# Altium project HFPB_01.PrjPcb (part 3 of 3)

## Sheet HFPB_01, PAGE-2.SchDoc
size 420 x 297 mm; PageSetup: Record=PageOptions|CenterHorizontal=True|CenterVertical=True|PrintScale=0.71|XCorrection=1.00|YCorrection=1.00|PrintKind=0|BorderSize=5000000|LeftOffset=0|BottomOffset=0|Orientation=2|PaperLength=1000|PaperWidth=1000|Scale=100|PaperSource=7|PrintQuality=-3|MediaType=1|DitherType=10|PaperKind=A4|PrintScaleMode=1; DocumentNumber: HFPB_01; Revision: .01; SheetNumber: 2; SheetTotal: 2; PageName: Power Bridge
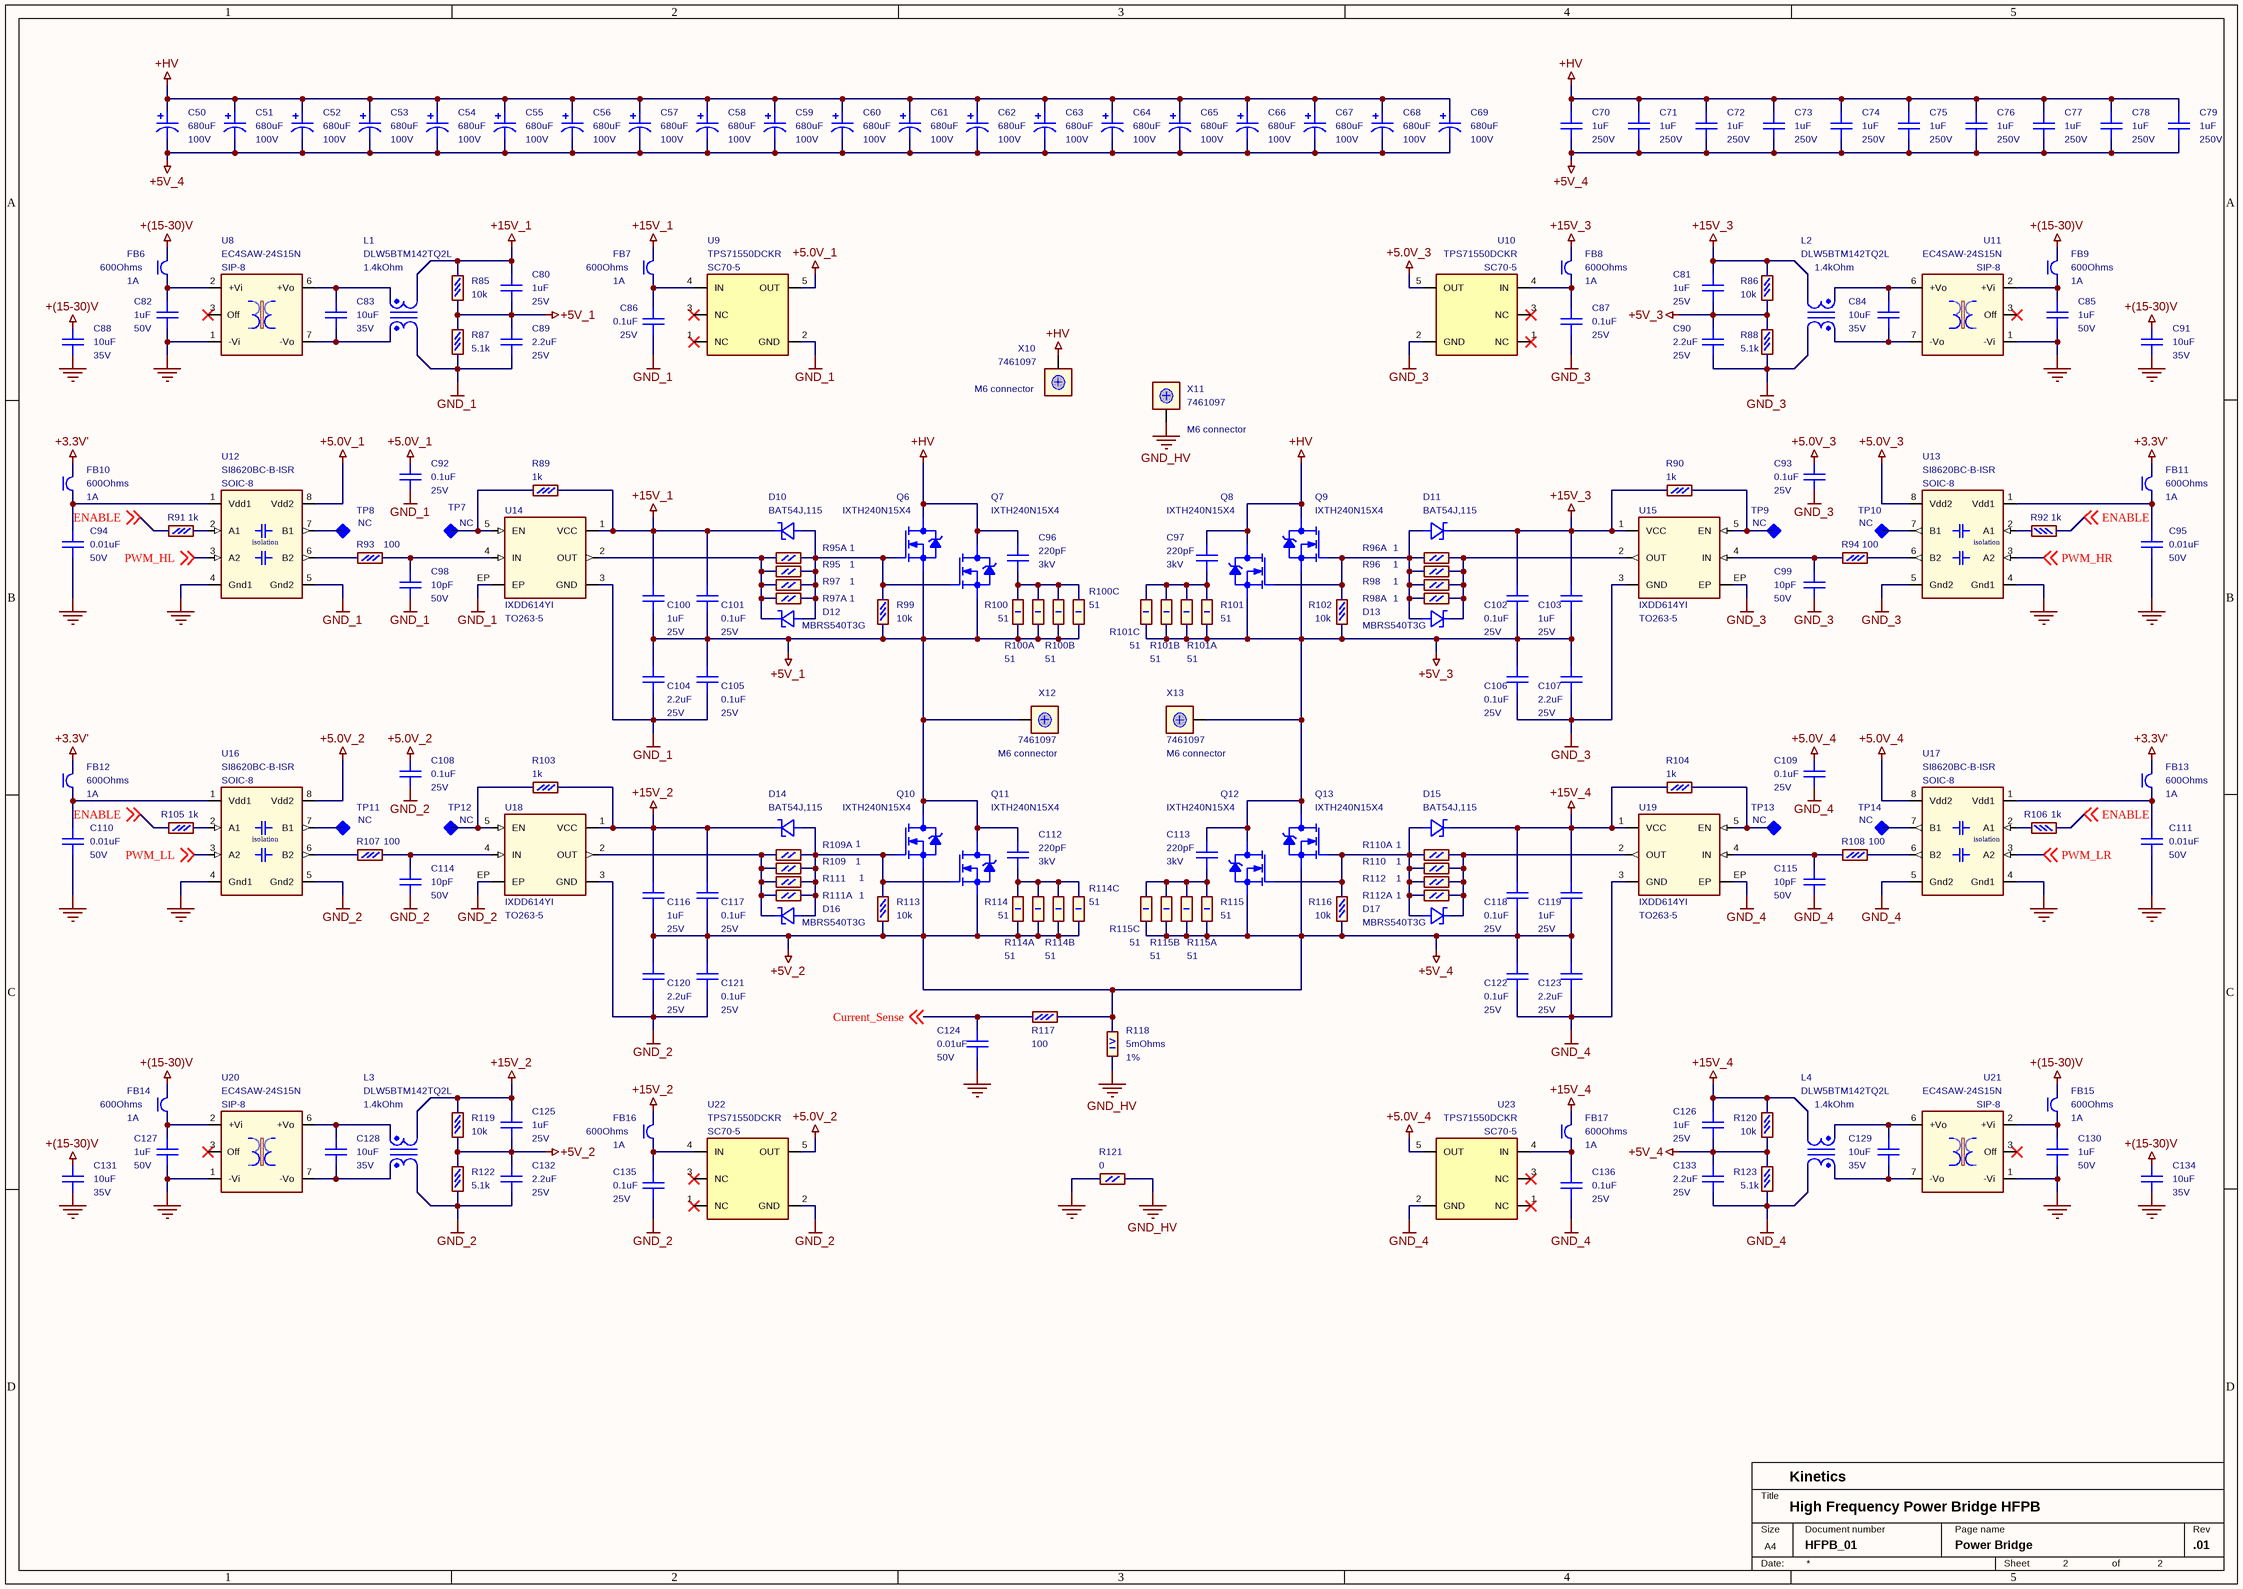
[diagram p1: HFPB_01, PAGE-2.SchDoc]

### Parts
C50  680uF  Value3: 100V  [CAPPRD750W80D1820H4200]
C51  680uF  Value3: 100V  [CAPPRD750W80D1820H4200]
C52  680uF  Value3: 100V  [CAPPRD750W80D1820H4200]
C53  680uF  Value3: 100V  [CAPPRD750W80D1820H4200]
C54  680uF  Value3: 100V  [CAPPRD750W80D1820H4200]
C55  680uF  Value3: 100V  [CAPPRD750W80D1820H4200]
C56  680uF  Value3: 100V  [CAPPRD750W80D1820H4200]
C57  680uF  Value3: 100V  [CAPPRD750W80D1820H4200]
C58  680uF  Value3: 100V  [CAPPRD750W80D1820H4200]
C59  680uF  Value3: 100V  [CAPPRD750W80D1820H4200]
C60  680uF  Value3: 100V  [CAPPRD750W80D1820H4200]
C61  680uF  Value3: 100V  [CAPPRD750W80D1820H4200]
C62  680uF  Value3: 100V  [CAPPRD750W80D1820H4200]
C63  680uF  Value3: 100V  [CAPPRD750W80D1820H4200]
C64  680uF  Value3: 100V  [CAPPRD750W80D1820H4200]
C65  680uF  Value3: 100V  [CAPPRD750W80D1820H4200]
C66  680uF  Value3: 100V  [CAPPRD750W80D1820H4200]
C67  680uF  Value3: 100V  [CAPPRD750W80D1820H4200]
C68  680uF  Value3: 100V  [CAPPRD750W80D1820H4200]
C69  680uF  Value3: 100V  [CAPPRD750W80D1820H4200]
C70  1uF  Value3: 250V  [CAPC570X500X160L60N]
C71  1uF  Value3: 250V  [CAPC570X500X160L60N]
C72  1uF  Value3: 250V  [CAPC570X500X160L60N]
C73  1uF  Value3: 250V  [CAPC570X500X160L60N]
C74  1uF  Value3: 250V  [CAPC570X500X160L60N]
C75  1uF  Value3: 250V  [CAPC570X500X160L60N]
C76  1uF  Value3: 250V  [CAPC570X500X160L60N]
C77  1uF  Value3: 250V  [CAPC570X500X160L60N]
C78  1uF  Value3: 250V  [CAPC570X500X160L60N]
C79  1uF  Value3: 250V  [CAPC570X500X160L60N]
C80  1uF  Value3: 25V  [CAPC160X80X80L35N - Full legend]
C81  1uF  Value3: 25V  [CAPC160X80X80L35N - Full legend]
C82  1uF  Value3: 50V  [CAPC160X80X80L35N - Full legend]
C83  10uF  Value3: 35V  [CAPC320X250X280L60N - full legend]
C84  10uF  Value3: 35V  [CAPC320X250X280L60N - full legend]
C85  1uF  Value3: 50V  [CAPC160X80X80L35N - Full legend]
C86  0.1uF  Value3: 25V  [CAPC160X80X80L35N - Full legend]
C87  0.1uF  Value3: 25V  [CAPC160X80X80L35N - Full legend]
C88  10uF  Value3: 35V  [CAPC320X250X280L60N - full legend]
C89  2.2uF  Value3: 25V  [CAPC160X80X80L35N - Full legend]
C90  2.2uF  Value3: 25V  [CAPC160X80X80L35N - Full legend]
C91  10uF  Value3: 35V  [CAPC320X250X280L60N - full legend]
C92  0.1uF  Value3: 25V  [CAPC160X80X80L35N - Full legend]
C93  0.1uF  Value3: 25V  [CAPC160X80X80L35N - Full legend]
C94  0.01uF  Value3: 50V  [CAPC160X80X80L35N - Full legend]
C95  0.01uF  Value3: 50V  [CAPC160X80X80L35N - Full legend]
C96  220pF  Value3: 3kV  [CAPC450X320X140L60N]
C97  220pF  Value3: 3kV  [CAPC450X320X140L60N]
C98  10pF  Value3: 50V  [CAPC160X80X80L35N - Full legend]
C99  10pF  Value3: 50V  [CAPC160X80X80L35N - Full legend]
C100  1uF  Value3: 25V  [CAPC160X80X80L35N - Full legend]
C101  0.1uF  Value3: 25V  [CAPC160X80X80L35N - Full legend]
C102  0.1uF  Value3: 25V  [CAPC160X80X80L35N - Full legend]
C103  1uF  Value3: 25V  [CAPC160X80X80L35N - Full legend]
C104  2.2uF  Value3: 25V  [CAPC160X80X80L35N - Full legend]
C105  0.1uF  Value3: 25V  [CAPC160X80X80L35N - Full legend]
C106  0.1uF  Value3: 25V  [CAPC160X80X80L35N - Full legend]
C107  2.2uF  Value3: 25V  [CAPC160X80X80L35N - Full legend]
C108  0.1uF  Value3: 25V  [CAPC160X80X80L35N - Full legend]
C109  0.1uF  Value3: 25V  [CAPC160X80X80L35N - Full legend]
C110  0.01uF  Value3: 50V  [CAPC160X80X80L35N - Full legend]
C111  0.01uF  Value3: 50V  [CAPC160X80X80L35N - Full legend]
C112  220pF  Value3: 3kV  [CAPC450X320X140L60N]
C113  220pF  Value3: 3kV  [CAPC450X320X140L60N]
C114  10pF  Value3: 50V  [CAPC160X80X80L35N - Full legend]
C115  10pF  Value3: 50V  [CAPC160X80X80L35N - Full legend]
C116  1uF  Value3: 25V  [CAPC160X80X80L35N - Full legend]
C117  0.1uF  Value3: 25V  [CAPC160X80X80L35N - Full legend]
C118  0.1uF  Value3: 25V  [CAPC160X80X80L35N - Full legend]
C119  1uF  Value3: 25V  [CAPC160X80X80L35N - Full legend]
C120  2.2uF  Value3: 25V  [CAPC160X80X80L35N - Full legend]
C121  0.1uF  Value3: 25V  [CAPC160X80X80L35N - Full legend]
C122  0.1uF  Value3: 25V  [CAPC160X80X80L35N - Full legend]
C123  2.2uF  Value3: 25V  [CAPC160X80X80L35N - Full legend]
C124  0.01uF  Value3: 50V  [CAPC160X80X80L35N - Full legend]
C125  1uF  Value3: 25V  [CAPC160X80X80L35N - Full legend]
C126  1uF  Value3: 25V  [CAPC160X80X80L35N - Full legend]
C127  1uF  Value3: 50V  [CAPC160X80X80L35N - Full legend]
C128  10uF  Value3: 35V  [CAPC320X250X280L60N - full legend]
C129  10uF  Value3: 35V  [CAPC320X250X280L60N - full legend]
C130  1uF  Value3: 50V  [CAPC160X80X80L35N - Full legend]
C131  10uF  Value3: 35V  [CAPC320X250X280L60N - full legend]
C132  2.2uF  Value3: 25V  [CAPC160X80X80L35N - Full legend]
C133  2.2uF  Value3: 25V  [CAPC160X80X80L35N - Full legend]
C134  10uF  Value3: 35V  [CAPC320X250X280L60N - full legend]
C135  0.1uF  Value3: 25V  [CAPC160X80X80L35N - Full legend]
C136  0.1uF  Value3: 25V  [CAPC160X80X80L35N - Full legend]
D10  BAT54J,115  [SODFL250X125X80L40X32N]
D11  BAT54J,115  [SODFL250X125X80L40X32N]
D12  MBRS540T3G  [DIOM795X585X240L100X300N]
D13  MBRS540T3G  [DIOM795X585X240L100X300N]
D14  BAT54J,115  [SODFL250X125X80L40X32N]
D15  BAT54J,115  [SODFL250X125X80L40X32N]
D16  MBRS540T3G  [DIOM795X585X240L100X300N]
D17  MBRS540T3G  [DIOM795X585X240L100X300N]
FB6  600Ohms  Value1: 1A  [BEADC160X80X80L30N]
FB7  600Ohms  Value1: 1A  [BEADC160X80X80L30N]
FB8  600Ohms  Value1: 1A  [BEADC160X80X80L30N]
FB9  600Ohms  Value1: 1A  [BEADC160X80X80L30N]
FB10  600Ohms  Value1: 1A  [BEADC160X80X80L30N]
FB11  600Ohms  Value1: 1A  [BEADC160X80X80L30N]
FB12  600Ohms  Value1: 1A  [BEADC160X80X80L30N]
FB13  600Ohms  Value1: 1A  [BEADC160X80X80L30N]
FB14  600Ohms  Value1: 1A  [BEADC160X80X80L30N]
FB15  600Ohms  Value1: 1A  [BEADC160X80X80L30N]
FB16  600Ohms  Value1: 1A  [BEADC160X80X80L30N]
FB17  600Ohms  Value1: 1A  [BEADC160X80X80L30N]
L1  DLW5BTM142TQ2L  value 1.4kOhm  [MURATA_DLW5BTM142TQ2L]
L2  DLW5BTM142TQ2L  value 1.4kOhm  [MURATA_DLW5BTM142TQ2L]
L3  DLW5BTM142TQ2L  value 1.4kOhm  [MURATA_DLW5BTM142TQ2L]
L4  DLW5BTM142TQ2L  value 1.4kOhm  [MURATA_DLW5BTM142TQ2L]
Q6  IXTH240N15X4  [TO247-3 - sgib]
Q7  IXTH240N15X4  [TO247-3 - short pins]
Q8  IXTH240N15X4  [TO247-3 - short pins]
Q9  IXTH240N15X4  [TO247-3 - sgib]
Q10  IXTH240N15X4  [TO247-3 - sgib]
Q11  IXTH240N15X4  [TO247-3 - short pins]
Q12  IXTH240N15X4  [TO247-3 - short pins]
Q13  IXTH240N15X4  [TO247-3 - sgib]
R85  10k  [RESC160X80X55L30N - Full legend]
R86  10k  [RESC160X80X55L30N - Full legend]
R87  5.1k  [RESC160X80X55L30N - Full legend]
R88  5.1k  [RESC160X80X55L30N - Full legend]
R89  1k  [RESC160X80X55L30N - Full legend]
R90  1k  [RESC160X80X55L30N - Full legend]
R91  1k  [RESC160X80X55L30N - Full legend]
R92  1k  [RESC160X80X55L30N - Full legend]
R93  100  [RESC160X80X55L30N - Full legend]
R94  100  [RESC160X80X55L30N - Full legend]
R95  1  [RESC200X125X70L40N - full legend]
R95A  1  [RESC200X125X70L40N - full legend]  (graphical)
R96  1  [RESC200X125X70L40N - full legend]
R96A  1  [RESC200X125X70L40N - full legend]  (graphical)
R97  1  [RESC200X125X70L40N - full legend]
R97A  1  [RESC200X125X70L40N - full legend]  (graphical)
R98  1  [RESC200X125X70L40N - full legend]
R98A  1  [RESC200X125X70L40N - full legend]  (graphical)
R99  10k  [RESC160X80X55L30N - Full legend]
R100  51  [RESC640X320X70L60N]
R100A  51  [RESC640X320X70L60N]  (graphical)
R100B  51  [RESC640X320X70L60N]  (graphical)
R100C  51  [RESC640X320X70L60N]  (graphical)
R101  51  [RESC640X320X70L60N]
R101A  51  [RESC640X320X70L60N]  (graphical)
R101B  51  [RESC640X320X70L60N]  (graphical)
R101C  51  [RESC640X320X70L60N]  (graphical)
R102  10k  [RESC160X80X55L30N - Full legend]
R103  1k  [RESC160X80X55L30N - Full legend]
R104  1k  [RESC160X80X55L30N - Full legend]
R105  1k  [RESC160X80X55L30N - Full legend]
R106  1k  [RESC160X80X55L30N - Full legend]
R107  100  [RESC160X80X55L30N - Full legend]
R108  100  [RESC160X80X55L30N - Full legend]
R109  1  [RESC200X125X70L40N - full legend]
R109A  1  [RESC200X125X70L40N - full legend]  (graphical)
R110  1  [RESC200X125X70L40N - full legend]
R110A  1  [RESC200X125X70L40N - full legend]  (graphical)
R111  1  [RESC200X125X70L40N - full legend]
R111A  1  [RESC200X125X70L40N - full legend]  (graphical)
R112  1  [RESC200X125X70L40N - full legend]
R112A  1  [RESC200X125X70L40N - full legend]  (graphical)
R113  10k  [RESC160X80X55L30N - Full legend]
R114  51  [RESC640X320X70L60N]
R114A  51  [RESC640X320X70L60N]  (graphical)
R114B  51  [RESC640X320X70L60N]  (graphical)
R114C  51  [RESC640X320X70L60N]  (graphical)
R115  51  [RESC640X320X70L60N]
R115A  51  [RESC640X320X70L60N]  (graphical)
R115B  51  [RESC640X320X70L60N]  (graphical)
R115C  51  [RESC640X320X70L60N]  (graphical)
R116  10k  [RESC160X80X55L30N - Full legend]
R117  100  [RESC160X80X55L30N - Full legend]
R118  5mOhms  Value1: 1%  [RESC670X720X125L115N]
R119  10k  [RESC160X80X55L30N - Full legend]
R120  10k  [RESC160X80X55L30N - Full legend]
R121  0  [RESC200X125X70L40N - full legend]
R122  5.1k  [RESC160X80X55L30N - Full legend]
R123  5.1k  [RESC160X80X55L30N - Full legend]
TP7  NC  [hole/0.8/1.4-R]
TP8  NC  [hole/0.8/1.4-R]
TP9  NC  [hole/0.8/1.4-R]
TP10  NC  [hole/0.8/1.4-R]
TP11  NC  [hole/0.8/1.4-R]
TP12  NC  [hole/0.8/1.4-R]
TP13  NC  [hole/0.8/1.4-R]
TP14  NC  [hole/0.8/1.4-R]
U8  EC4SAW-24S15N  Package/Case: SIP-8  [SIP950W50P254L2200H1150Q8]
U9  TPS71550DCKR  Package/Case: SC70-5  [SOT23-5P65_210X110L36X22N]
U10  TPS71550DCKR  Package/Case: SC70-5  [SOT23-5P65_210X110L36X22N]
U11  EC4SAW-24S15N  Package/Case: SIP-8  [SIP950W50P254L2200H1150Q8]
U12  SI8620BC-B-ISR  [SOIC-8]
U13  SI8620BC-B-ISR  [SOIC-8]
U14  IXDD614YI  Package/Case: TO263-5  [DPAK6P170_1524X482L228X75T770X800N]
U15  IXDD614YI  Package/Case: TO263-5  [DPAK6P170_1524X482L228X75T770X800N]
U16  SI8620BC-B-ISR  [SOIC-8]
U17  SI8620BC-B-ISR  [SOIC-8]
U18  IXDD614YI  Package/Case: TO263-5  [DPAK6P170_1524X482L228X75T770X800N]
U19  IXDD614YI  Package/Case: TO263-5  [DPAK6P170_1524X482L228X75T770X800N]
U20  EC4SAW-24S15N  Package/Case: SIP-8  [SIP950W50P254L2200H1150Q8]
U21  EC4SAW-24S15N  Package/Case: SIP-8  [SIP950W50P254L2200H1150Q8]
U22  TPS71550DCKR  Package/Case: SC70-5  [SOT23-5P65_210X110L36X22N]
U23  TPS71550DCKR  Package/Case: SC70-5  [SOT23-5P65_210X110L36X22N]
X10  7461097  Mating with: M6 connector  [Wurth_7461097]
X11  7461097  Mating with: M6 connector  [Wurth_7461097]
X12  7461097  Mating with: M6 connector  [Wurth_7461097]
X13  7461097  Mating with: M6 connector  [Wurth_7461097]

### Nets
+3.3V': FB10.1 FB11.1 FB12.1 FB13.1
+5.0V_1: C92.1 U9.5(OUT) U12.8(Vdd2)
+5.0V_2: C108.1 U16.8(Vdd2) U22.5(OUT)
+5.0V_3: C93.1 U10.5(OUT) U13.8(Vdd2)
+5.0V_4: C109.1 U17.8(Vdd2) U23.5(OUT)
+5V_1: C80.2 C89.1 C100.2 C101.2 C104.1 C105.1 C112.1 Q6.3(S) Q7.3(S) Q10.2(D) Q11.2(D) R85.1 R87.2 R99.1 R100.1 R100A.1 R100B.1 R100C.1 X12.1
+5V_2: C50.N C51.N C52.N C53.N C54.N C55.N C56.N C57.N C58.N C59.N C60.N C61.N C62.N C63.N C64.N C65.N C66.N C67.N C68.N C69.N C70.2 C71.2 C72.2 C73.2 C74.2 C75.2 C76.2 C77.2 C78.2 C79.2 C116.2 C117.2 C118.2 C119.2 C120.1 C121.1 C122.1 C123.1 C125.2 C126.2 C132.1 C133.1 Q10.3(S) Q11.3(S) Q12.3(S) Q13.3(S) R113.1 R114.1 R114A.1 R114B.1 R114C.1 R115.1 R115A.1 R115B.1 R115C.1 R116.1 R117.1 R118.2 R119.1 R120.1 R122.2 R123.2  [also labelled +5V_4]
+5V_3: C81.2 C90.1 C102.2 C103.2 C106.1 C107.1 C113.1 Q8.3(S) Q9.3(S) Q12.2(D) Q13.2(D) R86.1 R88.2 R101.1 R101A.1 R101B.1 R101C.1 R102.1 X13.1
+15V_1: C80.1 C100.1 C101.1 D10.C FB7.1 L1.3 R85.2 R89.2 U14.1(VCC)
+15V_2: C116.1 C117.1 C125.1 D14.C FB16.1 L3.2 R103.2 R119.2 U18.1(VCC)
+15V_3: C81.1 C102.1 C103.1 D11.C FB8.1 L2.3 R86.2 R90.1 U15.1(VCC)
+15V_4: C118.1 C119.1 C126.1 D15.C FB17.1 L4.2 R104.1 R120.2 U19.1(VCC)
+(15-30)V: C88.1 C91.1 C131.1 C134.1 FB6.1 FB9.1 FB14.1 FB15.1
+HV: C50.P C51.P C52.P C53.P C54.P C55.P C56.P C57.P C58.P C59.P C60.P C61.P C62.P C63.P C64.P C65.P C66.P C67.P C68.P C69.P C70.1 C71.1 C72.1 C73.1 C74.1 C75.1 C76.1 C77.1 C78.1 C79.1 C96.1 C97.1 Q6.2(D) Q7.2(D) Q8.2(D) Q9.2(D) X10.1
GND: C82.2 C85.2 C88.2 C91.2 C94.2 C95.2 C110.2 C111.2 C124.2 C127.2 C130.2 C131.2 C134.2 R121.1 U8.1(-Vi) U11.1(-Vi) U12.4(Gnd1) U13.4(Gnd1) U16.4(Gnd1) U17.4(Gnd1) U20.1(-Vi) U21.1(-Vi)
GND_1: C86.2 C89.2 C92.2 C98.2 C104.2 C105.2 L1.2 R87.1 U9.2(GND) U12.5(Gnd2) U14.3(GND) U14.EP
GND_2: C108.2 C114.2 C120.2 C121.2 C132.2 C135.2 L3.3 R122.1 U16.5(Gnd2) U18.3(GND) U18.EP U22.2(GND)
GND_3: C87.2 C90.2 C93.2 C99.2 C106.2 C107.2 L2.2 R88.1 U10.2(GND) U13.5(Gnd2) U15.3(GND) U15.EP
GND_4: C109.2 C115.2 C122.2 C123.2 C133.2 C136.2 L4.3 R123.1 U17.5(Gnd2) U19.3(GND) U19.EP U23.2(GND)
GND_HV: R118.1 R121.2 X11.1
Current_Sense: C124.1 R117.2 ; off-sheet Current_Sense
ENABLE: R91.1 R92.1 R105.1 R106.1 ; off-sheet ENABLE
PWM_HL: U12.3(A2) ; off-sheet PWM_HL
PWM_HR: U13.3(A2) ; off-sheet PWM_HR
PWM_LL: U16.3(A2) ; off-sheet PWM_LL
PWM_LR: U17.3(A2) ; off-sheet PWM_LR
NetC82_1: C82.1 FB6.2 U8.2(+Vi)
NetC83_1: C83.1 L1.4 U8.6(+Vo)
NetC83_2: C83.2 L1.1 U8.7(-Vo)
NetC84_1: C84.1 L2.4 U11.6(+Vo)
NetC84_2: C84.2 L2.1 U11.7(-Vo)
NetC85_1: C85.1 FB9.2 U11.2(+Vi)
NetC86_1: C86.1 FB7.2 U9.4(IN)
NetC87_1: C87.1 FB8.2 U10.4(IN)
NetC94_1: C94.1 FB10.2 U12.1(Vdd1)
NetC95_1: C95.1 FB11.2 U13.1(Vdd1)
NetC96_2: C96.2 R100.2 R100A.2 R100B.2 R100C.2
NetC97_2: C97.2 R101.2 R101A.2 R101B.2 R101C.2
NetC98_1: C98.1 R93.2 U14.4(IN)
NetC99_1: C99.1 R94.1 U15.4(IN)
NetC110_1: C110.1 FB12.2 U16.1(Vdd1)
NetC111_1: C111.1 FB13.2 U17.1(Vdd1)
NetC112_2: C112.2 R114.2 R114A.2 R114B.2 R114C.2
NetC113_2: C113.2 R115.2 R115A.2 R115B.2 R115C.2
NetC114_1: C114.1 R107.2 U18.4(IN)
NetC115_1: C115.1 R108.1 U19.4(IN)
NetC127_1: C127.1 FB14.2 U20.2(+Vi)
NetC128_1: C128.1 L3.1 U20.6(+Vo)
NetC128_2: C128.2 L3.4 U20.7(-Vo)
NetC129_1: C129.1 L4.1 U21.6(+Vo)
NetC129_2: C129.2 L4.4 U21.7(-Vo)
NetC130_1: C130.1 FB15.2 U21.2(+Vi)
NetC135_1: C135.1 FB16.2 U22.4(IN)
NetC136_1: C136.1 FB17.2 U23.4(IN)
NetD10_A: D10.A D12.A Q6.1(G) Q7.1(G) R95.2 R95A.2 R97.2 R97A.2 R99.2
NetD11_A: D11.A D13.A Q8.1(G) Q9.1(G) R96.1 R96A.1 R98.1 R98A.1 R102.2
NetD12_C: D12.C R95.1 R95A.1 R97.1 R97A.1 U14.2(OUT)
NetD13_C: D13.C R96.2 R96A.2 R98.2 R98A.2 U15.2(OUT)
NetD14_A: D14.A D16.A Q10.1(G) Q11.1(G) R109.2 R109A.2 R111.2 R111A.2 R113.2
NetD15_A: D15.A D17.A Q12.1(G) Q13.1(G) R110.1 R110A.1 R112.1 R112A.1 R116.2
NetD16_C: D16.C R109.1 R109A.1 R111.1 R111A.1 U18.2(OUT)
NetD17_C: D17.C R110.2 R110A.2 R112.2 R112A.2 U19.2(OUT)
NetR89_1: R89.1 TP7.1 U14.5(EN)
NetR90_2: R90.2 TP9.1 U15.5(EN)
NetR91_2: R91.2 U12.2(A1)
NetR92_2: R92.2 U13.2(A1)
NetR93_1: R93.1 U12.6(B2)
NetR94_2: R94.2 U13.6(B2)
NetR103_1: R103.1 TP12.1 U18.5(EN)
NetR104_2: R104.2 TP13.1 U19.5(EN)
NetR105_2: R105.2 U16.2(A1)
NetR106_2: R106.2 U17.2(A1)
NetR107_1: R107.1 U16.6(B2)
NetR108_2: R108.2 U17.6(B2)
NetTP8_1: TP8.1 U12.7(B1)
NetTP10_1: TP10.1 U13.7(B1)
NetTP11_1: TP11.1 U16.7(B1)
NetTP14_1: TP14.1 U17.7(B1)

Not connected (* = marked no-connect by the designer): U8 3(Off)* 14(NC); U9 1(NC)* 3(NC)*; U10 1(NC)* 3(NC)*; U11 3(Off)* 14(NC); U20 3(Off)* 14(NC); U21 3(Off)* 14(NC); U22 1(NC)* 3(NC)*; U23 1(NC)* 3(NC)*

### Notes on the sheet
- Kinetics
- High Frequency Power Bridge HFPB
- Size
- Title
- Document number
- Page name
- Rev
- Date:
- A4
- Sheet
- of
- (in symbol SI8620BC-B-ISR) isolation

### Library data of the parts
C50-C69 = EEU-FC2A681: Capacitor Aluminum Electrolytic Radial 680µF 100V 36mOhm; Manufacturer: Panasonic; Part Description: Polymer Radial 100µF 20% 35V 25mOhm 2000h; Value1: 5000h; Part number: EEU-FC2A681; Value2: 36mOhm; CompType: Capacitor; Value: 680uF; Package/Case: Radial, T/H 40.0x18.0; Datasheet link: https://industrial.panasonic.com/cdbs/www-data/pdf/RDF0000/ABA0000C1209.pdf; Price per 1p (1), $: 3.0; Price per 1p (1000), $: 1.2; Comment for circuit: *; Mouser number: 667-EEU-FC2A681; Digikey number: P10875-ND; Alternative: *; Digikey link: https://www.digikey.com/en/products/detail/panasonic-electronic-components/EEU-FC2A681/285738?s=N4IgTCBcDaIKJwKoFoBiBhMBBAbADgEYQBdAXyA; Mouser link: https://www.mouser.com/ProductDetail/Panasonic/EEU-FC2A681?qs=%2Fha2pyFaduhEQn%252Bb0FuXjefFIggaKnk9L%252B3cS5CzWh0%3D
C70-C79 = C2220: Capacitor 2220; Part number: C2220C105KARACTU; Manufacturer: KEMET; Part Description: Ceramic 1uF 10% X7R 250V; Value1: 10%; Value2: X7R; CompType: Capacitor; Value: 1uF; Package/Case: SMD2220; Datasheet link: https://content.kemet.com/datasheets/KEM_C1011_X7R_TIP_RING_SMD.pdf; Price per 1p (1), $: 2.20; Price per 1p (1000), $: 0.90; Comment for circuit: *; Mouser number: 80-C2220C105KAR; Digikey number: 399-4690-1-ND; Alternative: *; Digikey link: https://www.digikey.com/en/products/detail/kemet/C2220C105KARACTU/992183; Mouser link: https://www.mouser.com/ProductDetail/KEMET/C2220C105KARACTU?qs=%2Fha2pyFaduhp05YE4c39qqkzok8yt%252BLJtgtCCdYW7hoIomCxB7M0sA%3D%3D
C80 C81 C100 C103 C116 C119 C125 C126 = C0603: Capacitor 0603; Part number: C1608X7R1E105K080AB; Manufacturer: TDK; Part Description: Ceramic 1uF 10% X7R 25V; Value1: 10%; Value2: X7R; CompType: Capacitor; Value: 1uF; Package/Case: SMD0603; Datasheet link: https://product.tdk.com/en/system/files?file=dam/doc/product/capacitor/ceramic/mlcc/catalog/mlcc_commercial_general_en.pdf; Price per 1p (1), $: 0.21; Price per 1p (1000), $: 0.04; Comment for circuit: *; Mouser number: 810-C1608X7R1E105K; Digikey number: 445-5956-1-ND; Alternative: *; Digikey link: https://www.digikey.com/en/products/detail/tdk-corporation/C1608X7R1E105K080AB/2443434; Mouser link: https://www.mouser.com/ProductDetail/TDK/C1608X7R1E105K080AB?qs=%2Fha2pyFaduhbvUZXXxHSPKihux7pk%2FWVkCyG6jxauGMJh0GxUX0uaQUYqa1ofngF
C82 C85 C127 C130 = C0603: Capacitor 0603; Part number: GRT188R61H105KE13D; Manufacturer: Murata; Part Description: Ceramic 1uF 10% X5R 50V; Value1: 10%; Value2: X5R; CompType: Capacitor; Value: 1uF; Package/Case: SMD0603; Datasheet link: https://search.murata.co.jp/Ceramy/image/img/A01X/G101/ENG/GRT188R61H105KE13-01.pdf; Price per 1p (1), $: 0.26; Price per 1p (1000), $: 0.05; Comment for circuit: *; Mouser number: 81-GRT188R61H105KE3D; Digikey number: 490-12330-1-ND; Alternative: *; Digikey link: https://www.digikey.com/en/products/detail/murata-electronics/GRT188R61H105KE13D/5416752; Mouser link: https://www.mouser.com/ProductDetail/Murata-Electronics/GRT188R61H105KE13D?qs=%2Fha2pyFaduhFE6YphrUpxtZHcvtFLtW5%252BvZuAhz4RSuwDm7lX%252BAYM08BAcXMzrSJ
C83 C84 C88 C91 C128 C129 C131 C134 = C1210: Capacitor 1210; Part number: C1210C106M6PACTU; Manufacturer: KEMET; Part Description: Ceramic 10uF 20% X5R 35V; Value1: 20%; Value2: X5R; CompType: Capacitor; Value: 10uF; Package/Case: SMD1210; Datasheet link: https://content.kemet.com/datasheets/KEM_C1006_X5R_SMD.pdf; Price per 1p (1), $: 0.96; Price per 1p (1000), $: 0.32; Comment for circuit: *; Mouser number: 80-C1210C106M6P; Digikey number: 399-5509-1-ND; Alternative: *; Digikey link: https://www.digikey.com/en/products/detail/kemet/C1210C106M6PACTU/1950669; Mouser link: https://www.mouser.com/ProductDetail/KEMET/C1210C106M6PACTU?qs=%2Fha2pyFaduiE5F3NeAx%252BstNZ0BfneUhBxisAs3aM8TbgY%252BzsDA%2Fe1Q%3D%3D
C86 C87 C92 C93 C101 C102 C105 C106 C108 C109 C117 C118 C121 C122 C135 C136 = C0603: Capacitor 0603; Part number: C0603C104K3RAC7082; Manufacturer: KEMET; Part Description: Ceramic 0.1uF 10% X7R 25V; Value1: 10%; Value2: X7R; CompType: Capacitor; Value: 0.1uF; Package/Case: SMD0603; Datasheet link: https://content.kemet.com/datasheets/KEM_C1002_X7R_SMD.pdf; Price per 1p (1), $: 0.11; Price per 1p (1000), $: 0.02; Comment for circuit: *; Mouser number: 80-C0603C104K3R7082; Digikey number: 399-C0603C104K3RAC7082CT-ND; Alternative: *; Digikey link: https://www.digikey.com/en/products/detail/kemet/C0603C104K3RAC7082/12700954; Mouser link: https://www.mouser.com/ProductDetail/KEMET/C0603C104K3RAC7082?qs=%2Fha2pyFadugh8U7pV%252BrBGp7heQ7z29T%252BvsWVbXyCAC0knLhltr70Nk4q6OvfRKW6
C89 = C0603: Capacitor 0603; Part number: C1608X5R1E225K080AB; Manufacturer: TDK; Part Description: Ceramic 2.2uF 10% X5R 25V; Value1: 10%; Value2: X5R; CompType: Capacitor; Value: 2.2uF; Package/Case: SMD0603; Datasheet link: https://product.tdk.com/en/system/files?file=dam/doc/product/capacitor/ceramic/mlcc/catalog/mlcc_commercial_general_en.pdf; Price per 1p (1), $: 0.25; Price per 1p (1000), $: 0.05; Comment for circuit: *; Mouser number: 810-C1608X5R1E225K; Digikey number: 445-5964-1-ND; Alternative: *; Digikey link: https://www.digikey.com/en/products/detail/tdk-corporation/C1608X5R1E225K080AB/2443442; Mouser link: https://www.mouser.com/ProductDetail/TDK/C1608X5R1E225K080AB?qs=%2Fha2pyFaduirP9TymlGUul4f6A1oFNb6hTiY2LH9rXsl5JRxF%2FJ6mL29Xdq17qTS
C90 C104 C107 C120 C123 C132 C133 = C0603: Capacitor 0603; Part number: C1608X5R1E225K080AB; Manufacturer: TDK; Part Description: Ceramic 2.2uF 10% X5R 25V; Value1: 10%; Value2: X7R; CompType: Capacitor; Value: 2.2uF; Package/Case: SMD0603; Datasheet link: https://product.tdk.com/en/system/files?file=dam/doc/product/capacitor/ceramic/mlcc/catalog/mlcc_commercial_general_en.pdf; Price per 1p (1), $: 0.25; Price per 1p (1000), $: 0.05; Comment for circuit: *; Mouser number: 810-C1608X5R1E225K; Digikey number: 445-5964-1-ND; Alternative: *; Digikey link: https://www.digikey.com/en/products/detail/tdk-corporation/C1608X5R1E225K080AB/2443442; Mouser link: https://www.mouser.com/ProductDetail/TDK/C1608X5R1E225K080AB?qs=%2Fha2pyFaduirP9TymlGUul4f6A1oFNb6hTiY2LH9rXsl5JRxF%2FJ6mL29Xdq17qTS
C94 C95 C110 C111 C124 = C0603: Capacitor 0603; Part number: GRM1885C1H103JA01D; Manufacturer: Murata; Part Description: Ceramic 0.01uF 5% NP0 50V; Value1: 5%; Value2: NP0; CompType: Capacitor; Value: 0.01uF; Package/Case: SMD0603; Datasheet link: https://www.murata.com/-/media/webrenewal/support/library/catalog/products/capacitor/ceramiccapacitor/c02e.ashx?la=en-us&cvid=20210120024548000000; Price per 1p (1), $: 0.2; Price per 1p (1000), $: 0.04; Comment for circuit: *; Mouser number: 81-GRM1885C1H103JA1D; Digikey number: 490-9666-1-ND; Alternative: *; Digikey link: https://www.digikey.com/en/products/detail/murata-electronics/GRM1885C1H103JA01D/4421555; Mouser link: https://www.mouser.com/ProductDetail/Murata-Electronics/GRM1885C1H103JA01D?qs=%2Fha2pyFadug%2FvrC4VCXnldPdhfCgZBWBzBuM%2F5wKCqYfrzyFGWQkMbFjDTwqfUhJ
C96 C97 C112 C113 = C1812: Capacitor 1812; Part number: CGA8M1C0G3F221K200KA; Manufacturer: TDK; Part Description: Ceramic 220pF 10% NP0 3kV; Value1: 10%; Value2: NP0; CompType: Capacitor; Value: 220pF; Package/Case: SMD1812; Datasheet link: https://product.tdk.com/en/system/files?file=dam/doc/product/capacitor/ceramic/mlcc/catalog/mlcc_automotive_highvoltage_en.pdf; Price per 1p (1), $: 0.93; Price per 1p (1000), $: 0.34; Comment for circuit: *; Mouser number: 810-CGA8M1C0G3F221KA; Digikey number: 445-13094-1-ND; Alternative: *; Digikey link: https://www.digikey.com/en/products/detail/tdk-corporation/CGA8M1C0G3F221K200KA/3950330; Mouser link: https://www.mouser.com/ProductDetail/TDK/CGA8M1C0G3F221K200KA?qs=%2Fha2pyFadugRRZizCtF2bm6WjA5tvQdmbPUGLoma1JzK%252BCjwN9QqlbtkTq4JdeNm
C98 C99 C114 C115 = C0603: Capacitor 0603; Part number: GRM1885C1H100JA01D; Manufacturer: Murata; Part Description: Ceramic 10pF 5% NP0 50V; Value1: 5%; Value2: NP0; CompType: Capacitor; Value: 10pF; Package/Case: SMD0603; Datasheet link: https://www.murata.com/-/media/webrenewal/support/library/catalog/products/capacitor/ceramiccapacitor/c02e.ashx?la=en-us&cvid=20210120024548000000; Price per 1p (1), $: 0.12; Price per 1p (1000), $: 0.02; Comment for circuit: *; Mouser number: 81-GRM39C100D50; Digikey number: 490-1403-1-ND; Alternative: *; Digikey link: https://www.digikey.com/en/products/detail/murata-electronics/GRM1885C1H100JA01D/586930; Mouser link: https://www.mouser.com/ProductDetail/Murata-Electronics/GRM1885C1H100JA01D?qs=%2Fha2pyFadug%2FvrC4VCXnlbJmrOFMaxj30QUgA6YXUVlxuM%2FhvX8xlA%3D%3D
D10 D11 D14 D15 = BAT54J,115: Diode Schottky 30V 0.2A; Manufacturer: Nexperia; Value2: 0.8V; Part number: BAT54J,115; CompType: Diode; Package/Case: SOD-323F; Datasheet link: https://rocelec.widen.net/view/pdf/es9ugfukaw/PHGLS14913-1.pdf?t.download=true&u=5oefqw; Price per 1p (1), $: 0.24; Price per 1p (1000), $: 0.04; Comment for circuit: *; Mouser number: 771-BAT54J115; Digikey number: 1727-4818-1-ND; Alternative: *; Digikey link: https://www.digikey.com/en/products/detail/nexperia-usa-inc/BAT54J-115/1692654; Mouser link: https://www.mouser.com/ProductDetail/Nexperia/BAT54J115?qs=%2Fha2pyFadugI9ADa6WxEnxQzp3xOrOvOo4yhxZudU23LhjKFM4l8YQ%3D%3D; Value3: -; Part Description: Diode Schottky 30V 0.2A; Value1: 0.2A; Value: 30V
D12 D13 D16 D17 = MBRS540T3G: Diode Schottky 40V 5A; Manufacturer: ON Semiconductor; Value2: 0.5V; Part number: MBRS540T3G; CompType: Diode; Package/Case: SMC; Datasheet link: https://www.onsemi.com/pdf/datasheet/mbrs540t3-d.pdf; Price per 1p (1), $: 0.53; Price per 1p (1000), $: 0.2; Comment for circuit: *; Mouser number: 863-MBRS540T3G; Digikey number: MBRS540T3GOSCT-ND; Alternative: *; Digikey link: https://www.digikey.com/en/products/detail/on-semiconductor/MBRS540T3G/918647; Mouser link: https://www.mouser.com/ProductDetail/ON-Semiconductor/MBRS540T3G?qs=%2Fha2pyFaduhC0LQdY%2FqVaee8bZnksvp1EwMnsoQeoVc%3D; Value3: -; Part Description: Diode Schottky 40V 5A; Value1: 5A; Value: 40V
FB6-FB17 = MPZ1608S601ATA00: Ferrite Bead 600Ohms 1A; Manufacturer: TDK; Value2: 150mOhm; Part number: MPZ1608S601ATA00; CompType: Ferrite Bead; Value: 600Ohms; Package/Case: SMD0603; Datasheet link: https://product.tdk.com/info/en/catalog/datasheets/beads_commercial_power_mpz1608_en.pdf; Price per 1p (1), $: 0.1; Price per 1p (1000), $: 0.027; Comment for circuit: *; Mouser number: 810-MPZ1608S601ATA00; Digikey number: 445-2205-1-ND; Alternative: *; Digikey link: https://www.digikey.com/product-detail/en/tdk-corporation/MPZ1608S601ATA00/445-2205-1-ND/765103; Mouser link: https://www.mouser.com/ProductDetail/TDK/MPZ1608S601ATA00?qs=%2Fha2pyFadugcsOiFyIs3PqyLV4WV7NzmPQY%252BV8Rm%2F551LUqkOqXlQw%3D%3D; Part Description: Ferrite Bead 600Ohms 1A
L1-L4 = DLW5BTM142TQ2L: Common Mode Choke 2 lines 1.4kOhm 2A 56mOhm; Manufacturer: Murata; CompType: Inductor; Value3: 0.2Ohm; Part number: DLW5BTM142TQ2L; Package/Case: SMD-4; Datasheet link: https://www.murata.com/en-us/products/productdata/8796761587742/EFLC0025.pdf; Price per 1p (1), $: 1.7; Price per 1p (1000), $: 0.6; Comment for circuit: *; Mouser number: 81-DLW5BTM142TQ2L; Digikey number: 490-11110-1-ND; Alternative: *; Digikey link: https://www.digikey.com/en/products/detail/murata-electronics/DLW5BTM142TQ2L/4421377?s=N4IgTCBcDaICIBkDqBWAQgFQLIEYAsYGAimAiALoC%2BQA; Mouser link: https://www.mouser.com/ProductDetail/Murata-Electronics/DLW5BTM142TQ2L?qs=eTNEoJdcnEJfMtnluA8TOg%3D%3D; Part Description: Common Mode Choke 2 lines 1.4kOhm 2A 56mOhm; Value1: 2A; Value2: 56mOhm
Q6-Q13 = IXTH240N15X4: MOSFET N-chanel, 150V, 240A, 4.4mOhm; Manufacturer: IXYS; CompType: Transistor; Alternative: IRFP3077PbF, IRFP4568PbF; Part number: IXTH240N15X4; Price per 1p (1), $: 11.4; Price per 1p (1000), $: 7.4; Package/Case: TO247-3; Comment for circuit: *; Datasheet link: https://www.littelfuse.com/~/media/electronics/datasheets/discrete_mosfets/littelfuse_discrete_mosfets_n-channel_ultra_junction_ixt_240n15x4_datasheet.pdf.pdf; Digikey link: https://www.digikey.com/en/products/detail/ixys/IXTH240N15X4/10222203?s=N4IgTCBcDaIJIA0AqAJMAWADAOQIwFYF0QBdAXyA; Mouser link: https://www.mouser.com/ProductDetail/IXYS/IXTH240N15X4?qs=T3oQrply3y%252BbuTinOhn9MQ%3D%3D; Mouser number: 747-IXTH240N15X4; Part Description: MOSFET N-chanel, 150V, 240A, 4.4mOhm; Digikey number: IXTH240N15X4-ND
R85 R86 R99 R102 R113 R116 R119 R120 = R0603: Resistor 0603; Part number: ERJ-3EKF1002V; Manufacturer: Panasonic; Part Description: 10kOhm 1% 100ppm 0.1W; Value2: 100ppm; Value3: 0.1W; Value1: 1%; CompType: Resistor; Value: 10k; Package/Case: SMD0603; Datasheet link: https://industrial.panasonic.com/cdbs/www-data/pdf/RDA0000/AOA0000C304.pdf; Price per 1p (1), $: 0.1; Price per 1p (1000), $: 0.006; Comment for circuit: *; Mouser number: 667-ERJ-3EKF1002V; Digikey number: P10.0KHCT-ND; Alternative: *; Digikey link: https://www.digikey.com/product-detail/en/panasonic-electronic-components/ERJ-3EKF1002V/P10-0KHCT-ND/198102; Mouser link: https://www.mouser.com/ProductDetail/Panasonic/ERJ-3EKF1002V?qs=%2Fha2pyFaduglTbPDDZSypQEDK4AiCVGrTuiUVobO5VAELetEuVDpZg%3D%3D
R87 R88 R122 R123 = R0603: Resistor 0603; Part number: ERJ-3EKF5101V; Manufacturer: Panasonic; Part Description: 5.1kOhm 1% 100ppm 0.1W; Value2: 100ppm; Value3: 0.1W; Value1: 1%; CompType: Resistor; Value: 5.1k; Package/Case: SMD0603; Datasheet link: https://industrial.panasonic.com/cdbs/www-data/pdf/RDA0000/AOA0000C304.pdf; Price per 1p (1), $: 0.1; Price per 1p (1000), $: 0.006; Comment for circuit: *; Mouser number: 667-ERJ-3EKF5101V; Digikey number: P5.10KHCT-ND; Alternative: *; Digikey link: https://www.digikey.com/en/products/detail/panasonic-electronic-components/ERJ-3EKF5101V/1746427?s=N4IgjCBcoMxaBjKAzAhgGwM4FMA0IB7KAbXDBggF18AHAFyhAGU6AnASwDsBzEAX3xgAbPBBJIaLHkIkQMAJwAmACwjqIeoxYce-fIoAMADgCso8ZJz4ikUiYB0YAAQBrAPIALALaYQ6zZAgAKqc7HRuyACy2KiYAK6s2HogALQQ0GIoGFYytuAGfgKpZhkW2dI2pIqF%2BCnK5llS1rJGRkLycJR83UA; Mouser link: https://www.mouser.com/ProductDetail/Panasonic/ERJ-3EKF5101V?qs=%2Fha2pyFaduglTbPDDZSypWQJ%2FXQigzH6ZfrMId1zsTYqwog%252B7gPcvA%3D%3D
R89-R92 R103-R106 = R0603: Resistor 0603; Part number: ERJ-3EKF1001V; Manufacturer: Panasonic; Part Description: 1kOhm 1% 100ppm 0.1W; Value2: 100ppm; Value3: 0.1W; Value1: 1%; CompType: Resistor; Value: 1k; Package/Case: SMD0603; Datasheet link: https://industrial.panasonic.com/cdbs/www-data/pdf/RDA0000/AOA0000C304.pdf; Price per 1p (1), $: 0.1; Price per 1p (1000), $: 0.006; Comment for circuit: *; Mouser number: 667-ERJ-3EKF1001V; Digikey number: P1.00KHCT-ND; Alternative: *; Digikey link: https://www.digikey.com/product-detail/en/panasonic-electronic-components/ERJ-3EKF1001V/P1-00KHCT-ND/198071; Mouser link: https://www.mouser.com/ProductDetail/Panasonic/ERJ-3EKF1001V?qs=%2Fha2pyFaduglTbPDDZSypWE69I9nzuoo3rS5%252BQlSb3G8fLmmMx%252BY%2Fg%3D%3D
R93 R94 R107 R108 R117 = R0603: Resistor 0603; Part number: ERJ-3EKF1000V; Manufacturer: Panasonic; Part Description: 100Ohm 1% 100ppm 0.1W; Value2: 100ppm; Value3: 0.1W; Value1: 1%; CompType: Resistor; Value: 100; Package/Case: SMD0603; Datasheet link: https://industrial.panasonic.com/cdbs/www-data/pdf/RDA0000/AOA0000C304.pdf; Price per 1p (1), $: 0.1; Price per 1p (1000), $: 0.006; Mouser number: 667-ERJ-3EKF1000V; Digikey number: P100HCT-ND; Alternative: *; Digikey link: https://www.digikey.com/product-detail/en/panasonic-electronic-components/ERJ-3EKF1000V/P100HCT-ND/198109; Mouser link: https://www.mouser.com/ProductDetail/Panasonic/ERJ-3EKF1000V?qs=%2Fha2pyFaduglTbPDDZSypXi%252B1JYi5TJRT2R7dib9ms%2F8H45gLlep%2Fg%3D%3D
  R93 R94 R107 R108: Comment for circuit: *
R95 R95A R96 R96A R97 R97A R98 R98A R109 R109A R110 R110A R111 R111A R112 R112A = R0805: Resistor 0805; Part number: ERJ-6RQF1R0V; Manufacturer: Panasonic; Part Description: 1Ohm 1% 100ppm 0.1W; Value2: 100ppm; Value3: 0.1W; Value1: 1%; CompType: Resistor; Value: 1; Package/Case: SMD0805; Datasheet link: https://industrial.panasonic.com/cdbs/www-data/pdf/RDN0000/AOA0000C313.pdf; Price per 1p (1), $: 0.32; Price per 1p (1000), $: 0.04; Comment for circuit: *; Mouser number: 667-ERJ-6RQF1R0V; Digikey number: P1.0DCT-ND; Alternative: *; Digikey link: https://www.digikey.com/en/products/detail/panasonic-electronic-components/ERJ-6RQF1R0V/250172; Mouser link: https://www.mouser.com/ProductDetail/Panasonic/ERJ-6RQF1R0V?qs=%2Fha2pyFadui47ij%252B%252BE9lBN0XcJCSMm0uU%2Fu9U3%2F7zYb1i2ShqkJvag%3D%3D
R100 R100A R100B R100C R101 R101A R101B R101C R114 R114A R114B R114C R115 R115A R115B R115C = R2512: Resistor 2512; Part number: ERJ-1TYJ510U; Manufacturer: Panasonic; Part Description: 51Ohm 5% 200ppm 1W; Value2: 200ppm; Value3: 1W; Value1: 5%; CompType: Resistor; Value: 51; Package/Case: SMD2512; Datasheet link: https://media.digikey.com/pdf/Data%20Sheets/Panasonic%20Resistors%20Thermistors%20PDFs/ERJ-xG,14,12(Z),1T_Rev_Apr_2015.pdf; Price per 1p (1), $: 0.43; Price per 1p (1000), $: 0.07; Comment for circuit: *; Mouser number: 667-ERJ-1TYJ510U; Digikey number: PT51XCT-ND; Alternative: *; Digikey link: https://www.digikey.com/en/products/detail/panasonic-electronic-components/ERJ-1TYJ510U/365222?s=N4IgjCBcoMxaBjKAzAhgGwM4FMA0IB7KAbRACYBWABjgF18AHAFyhAGUmAnASwDsBzEAF98YAGzwQSSGix5CJcBQDsAFhoh6IZqw48Bw-GSoAOCpOmyc%2BIpFIUwAAgDyACwC2mTYxaQQAVV5uJmdkAFlsVEA
  R100 R101 R114 R115: Mouser link: https://www.mouser.com/ProductDetail/Panasonic/ERJ-1TYJ510U?qs=%2Fha2pyFaduj0UMXbjtMq91oGO475YlinjxD%252B84oJ%2FazDLcOO79sIVw%3D%3D
  R100A R100B R100C R101A R101B R101C R114A R114B R114C R115A R115B R115C: Mouser link: https://eu.mouser.com/ProductDetail/Panasonic/ERJ-1TYJ510U?qs=%2Fha2pyFaduj0UMXbjtMq91oGO475YlinjxD%252B84oJ%2FazDLcOO79sIVw%3D%3D
R118 = R2728: Resistor 2728; Part number: CSSH2728FT5L00; Manufacturer: Stackpole; Part Description: 5mOhms 1% 25ppm 4W; Value2: 25ppm; Value3: 4W; CompType: Resistor; Value: 5mOhms; Package/Case: SMD2728; Datasheet link: https://www.seielect.com/catalog/sei-css_cssh.pdf; Price per 1p (1), $: 1.0; Price per 1p (1000), $: 0.4; Comment for circuit: *; Mouser number: -; Digikey number: CSSH2728FT5L00CT-ND; Alternative: *; Digikey link: https://www.digikey.com/en/products/detail/stackpole-electronics-inc/CSSH2728FT5L00/1923229?s=N4IgTCBcDaIMIGUEAkwHYwA4BiAVArADIAMxIAugL5A; Mouser link: -
R121 = R0805: Resistor 0805; Part number: ERJ-6GEY0R00V; Manufacturer: Panasonic; Part Description: 0Ohm; CompType: Resistor; Value: 0; Package/Case: SMD0805; Datasheet link: https://industrial.panasonic.com/cdbs/www-data/pdf/RDA0000/AOA0000C301.pdf; Price per 1p (1), $: 0.1; Price per 1p (1000), $: 0.01; Comment for circuit: *; Mouser number: 667-ERJ-6GEY0R00V; Digikey number: P0.0ACT-ND; Alternative: *; Digikey link: https://www.digikey.com/en/products/detail/panasonic-electronic-components/ERJ-6GEY0R00V/78163; Mouser link: https://www.mouser.com/ProductDetail/Panasonic/ERJ-6GEY0R00V?qs=%2Fha2pyFaduiXHwl36i8QX36wZiKzn6ZC%252B%2FXCfh2OMu8zsRglrEz3MQ%3D%3D
TP7-TP14 = TEST POINT: Value1: 0.8mm; Value2: 1.4mm; CompType: Hole; Value: NC; Package/Case: -; Comment for circuit: *; Part Description: *
U8 U11 U20 U21 = EC4SAW-24S15N: DC/DC Converter 6W 1.5kV Isolated; Manufacturer: Cincon; CompType: Integrated circuit; Alternative: *; Comment for circuit: *; Datasheet link: https://www.cincon.com/productdownload/SPEC-EC4SAW-V12.pdf, https://www.cincon.com/productdownload/EC4SAW-SERIES-application-note.pdf; Digikey link: https://www.digikey.com/en/products/detail/cincon-electronics-co-ltd/EC4SAW-24S15N/9683268?s=N4IgTCBcDaIKIGEAsBlAggdQLRlQRgFYA5EAXQF8g; Digikey number: EC4SAW-24S15N; Mouser link: https://www.mouser.com/ProductDetail/Cincon/EC4SAW-24S15N?qs=%2Fha2pyFaduiGXo%2F8izrl2Opdn1C73MRZCbc2zfZkPUuoj8AECuablg%3D%3D; Mouser number: 418-EC4SAW-24S15N; Part Description: DC/DC Converter 6W 1.5kV Isolated; Part number: EC4SAW-24S15N; Price per 1p (1), $: 12.0; Price per 1p (1000), $: 10.0
U9 U10 U22 U23 = TPS71550DCKR: LDO 5.0V 50mA; Manufacturer: Texas Instruments; Part Description: LDO 3.3V 50mA; CompType: Integrated circuit; Alternative: *; Comment for circuit: *; Datasheet link: https://www.ti.com/lit/ds/symlink/tps715.pdf?HQS=dis-dk-null-digikeymode-dsf-pf-null-wwe&ts=1615331244877; Digikey link: https://www.digikey.com/en/products/detail/texas-instruments/TPS71550DCKR/562815; Digikey number: 296-15046-1-ND; Mouser link: https://www.mouser.com/ProductDetail/Texas-Instruments/TPS71550DCKR?qs=Gse6rAGbi7%252BvaZj1yCtdfw%3D%3D; Mouser number: 595-TPS71550DCKR; Part number: TPS71550DCKR; Price per 1p (1), $: 0.74; Price per 1p (1000), $: 0.28
U12 U13 U16 U17 = SI8620BC-B-ISR: Digital Isolator 3750Vrms 2 Channel 150Mbps; Manufacturer: Silicon Labs; CompType: Integrated circuit; Package/Case: SOIC-8; Alternative: *; Comment for circuit: *; Datasheet link: https://www.silabs.com/documents/public/data-sheets/si861x-2x-datasheet.pdf; Digikey link: https://www.digikey.com/en/products/detail/silicon-labs/SI8620BC-B-ISR/4069784?s=N4IgTCBcDaIMoEkAcA2MAGAQgYQLSdwTgCUQBdAXyA; Digikey number: 336-4330-1-ND; Mouser link: https://www.mouser.com/ProductDetail/Silicon-Labs/SI8620BC-B-ISR?qs=%2Fha2pyFadugs6A4vvJm%252BGaYG0423mMcOc3j31Gp1kfaMtdbhcRq0kg%3D%3D; Mouser number: 634-SI8620BC-B-ISR; Part Description: Digital Isolator 3750Vrms 2 Channel 150Mbps; Part number: SI8620BC-B-ISR; Price per 1p (1), $: 1.25; Price per 1p (1000), $: 1.15
U14 U15 U18 U19 = IXDD614YI: MOSFET Driver IC; Manufacturer: IXYS; CompType: Integrated circuit; Alternative: IXDN614YI; Comment for circuit: *; Datasheet link: https://www.ixysic.com/home/pdfs.nsf/0/18AB54BEE23C4E71852577520051C399/$file/IXD_614.pdf; Digikey link: https://www.digikey.com/en/products/detail/ixys-integrated-circuits-division/IXDD614YI/2391600?s=N4IgTCBcDaIJIA0AiSBsBGALATTiAugL5A; Digikey number: CLA338-ND; Mouser link: https://www.mouser.com/ProductDetail/IXYS-Integrated-Circuits/IXDD614YI/?qs=%2Fha2pyFaduiZAeBBqN5wty5ShYJ6%2FfWCWwL6htYUQeY%3D; Mouser number: 849-IXDD614YI; Part Description: MOSFET Driver IC; Part number: IXDD614YI; Price per 1p (1), $: 5.14; Price per 1p (1000), $: 2.58
X10-X13 = 7461097: Screw Terminal M6 16 pin; Manufacturer: Wurth Elektronik; CompType: Connector; Alternative: *; Comment for circuit: *; Datasheet link: https://www.we-online.de/katalog/datasheet/7461097.pdf; Digikey link: https://www.digikey.com/en/products/detail/w%C3%BCrth-elektronik/7461097/2682508; Digikey number: 732-3217-ND; Mouser link: https://www.mouser.com/ProductDetail/Wurth-Elektronik/7461097/?qs=%2Fha2pyFaduivfHmPS%2FalO0LxillnNa7WBZ9739yqip0%3D; Mouser number: 710-7461097; Package/Case: Through Hole; Part Description: Screw Terminal M6 16 pin; Part number: 7461097; Price per 1p (1), $: 5.15; Price per 1p (1000), $: 3.00

## Nets that join several sheets
+3.3V': HFPB_01, PAGE-1 (Q2.3 R17.1 R20.2), HFPB_01, PAGE-2 (FB10.1 FB11.1 FB12.1 FB13.1)
+(15-30)V: HFPB_01, PAGE-1 (11 pins), HFPB_01, PAGE-2 (8 pins)
+HV: HFPB_01, PAGE-1 (R1.2), HFPB_01, PAGE-2 (37 pins)
GND: HFPB_01, PAGE-1 (127 pins), HFPB_01, PAGE-2 (22 pins)
Current_Sense: HFPB_01, PAGE-1 (R45.2), HFPB_01, PAGE-2 (C124.1 R117.2)
ENABLE: HFPB_01, PAGE-1 (R55.1 U4.56), HFPB_01, PAGE-2 (R91.1 R92.1 R105.1 R106.1)
PWM_HL: HFPB_01, PAGE-1 (R32.2), HFPB_01, PAGE-2 (U12.3)
PWM_HR: HFPB_01, PAGE-1 (R6.2), HFPB_01, PAGE-2 (U13.3)
PWM_LL: HFPB_01, PAGE-1 (R12.2), HFPB_01, PAGE-2 (U16.3)
PWM_LR: HFPB_01, PAGE-1 (R27.2), HFPB_01, PAGE-2 (U17.3)